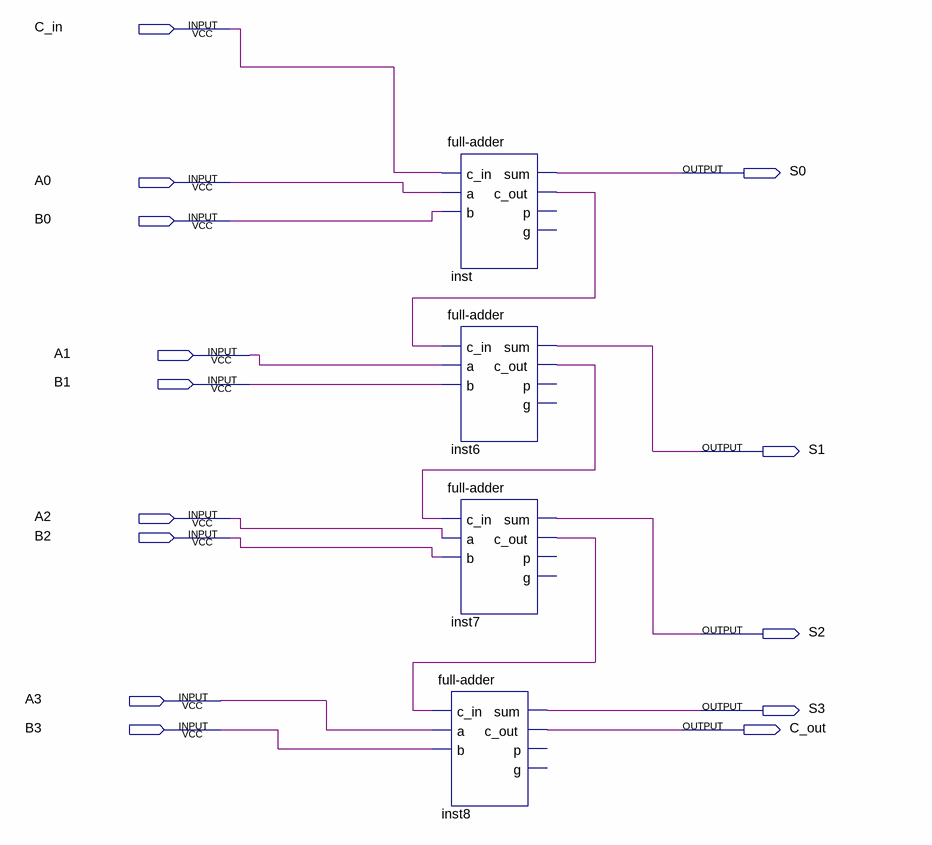
[diagram p0: schematic sheet]
// Quartus schematic 4-bit-ripple-carry.bdf as structural Verilog: 4 symbols, 14 pins
module \4-bit-ripple-carry  (
  input  C_in,
  input  A0,
  input  B0,
  input  A1,
  input  B1,
  input  A2,
  input  B2,
  input  A3,
  input  B3,
  output S0,
  output S1,
  output S2,
  output S3,
  output C_out
);

  wire inst6_c_out, inst7_c_out, inst_c_out;

  \full-adder  inst (.c_in(C_in), .a(A0), .b(B0), .sum(S0), .c_out(inst_c_out));  // open: p, g
  \full-adder  inst6 (.c_in(inst_c_out), .a(A1), .b(B1), .sum(S1), .c_out(inst6_c_out));  // open: p, g
  \full-adder  inst7 (.c_in(inst6_c_out), .a(A2), .b(B2), .sum(S2), .c_out(inst7_c_out));  // open: p, g
  \full-adder  inst8 (.c_in(inst7_c_out), .a(A3), .b(B3), .sum(S3), .c_out(C_out));  // open: p, g
endmodule
